# Altium schematic sheet IC201.schdoc
size 135 x 101 mm
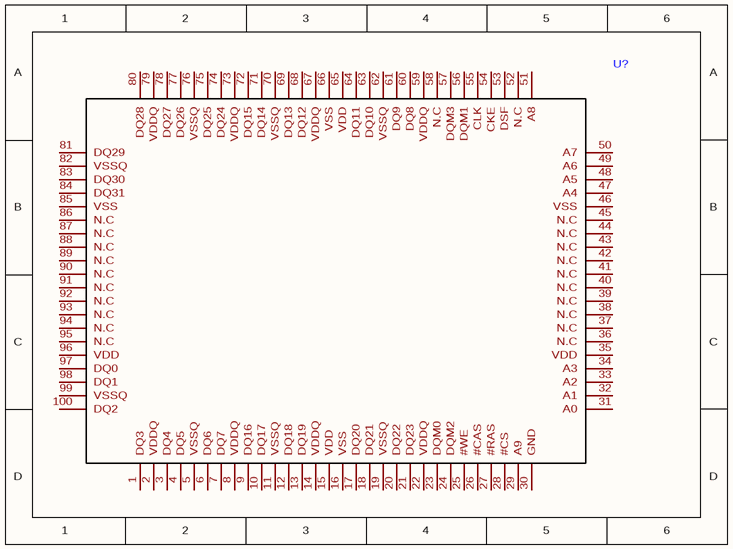
[diagram p0: IC201.schdoc]

## Parts
U?  (no value)  [LQFP-100_L20.0-W14.0-P0.65-LS16.0-BL-1]

## Nets

Not connected (* = marked no-connect by the designer): U? 1(DQ3) 2(VDDQ) 3(DQ4) 4(DQ5) 5(VSSQ) 6(DQ6) 7(DQ7) 8(VDDQ) 9(DQ16) 10(DQ17) 11(VSSQ) 12(DQ18) 13(DQ19) 14(VDDQ) 15(VDD) 16(VSS) 17(DQ20) 18(DQ21) 19(VSSQ) 20(DQ22) 21(DQ23) 22(VDDQ) 23(DQM0) 24(DQM2) 25(#WE) 26(#CAS) 27(#RAS) 28(#CS) 29(A9) 30(GND) 31(A0) 32(A1) 33(A2) 34(A3) 35(VDD) 36(N.C) 37(N.C) 38(N.C) 39(N.C) 40(N.C) 41(N.C) 42(N.C) 43(N.C) 44(N.C) 45(N.C) 46(VSS) 47(A4) 48(A5) 49(A6) 50(A7) 51(A8) 52(N.C) 53(DSF) 54(CKE) 55(CLK) 56(DQM1) 57(DQM3) 58(N.C) 59(VDDQ) 60(DQ8) 61(DQ9) 62(VSSQ) 63(DQ10) 64(DQ11) 65(VDD) 66(VSS) 67(VDDQ) 68(DQ12) 69(DQ13) 70(VSSQ) 71(DQ14) 72(DQ15) 73(VDDQ) 74(DQ24) 75(DQ25) 76(VSSQ) 77(DQ26) 78(DQ27) 79(VDDQ) 80(DQ28) 81(DQ29) 82(VSSQ) 83(DQ30) 84(DQ31) 85(VSS) 86(N.C) 87(N.C) 88(N.C) 89(N.C) 90(N.C) 91(N.C) 92(N.C) 93(N.C) 94(N.C) 95(N.C) 96(VDD) 97(DQ0) 98(DQ1) 99(VSSQ) 100(DQ2)

## Library data of the parts
U? = IC201